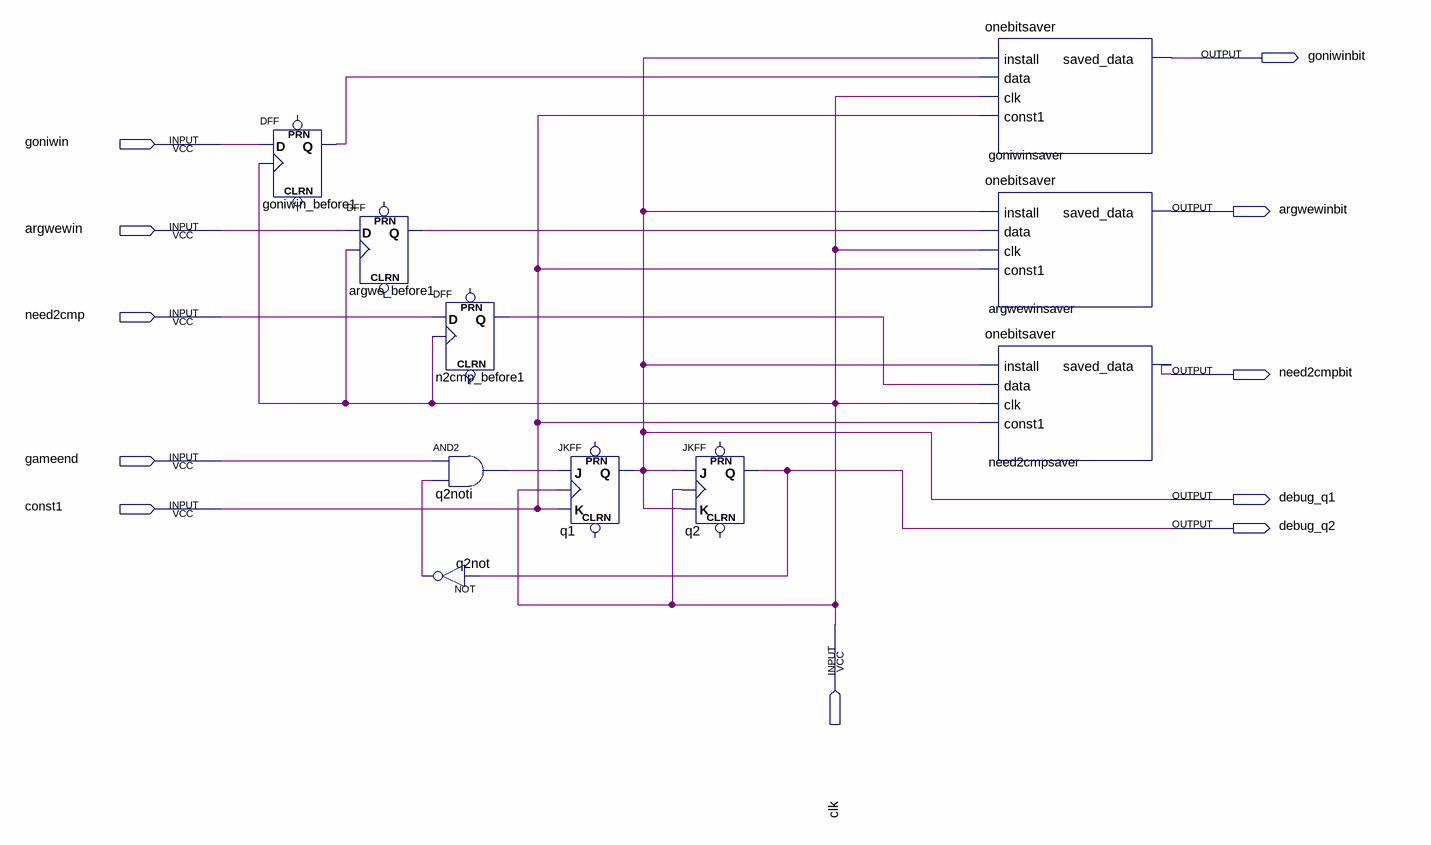
[diagram p0: schematic sheet]
// Quartus schematic battingsaver.bdf as structural Verilog: 10 symbols, 11 pins
module battingsaver (
  input  goniwin,
  input  argwewin,
  input  need2cmp,
  input  gameend,
  input  const1,
  input  clk,
  output goniwinbit,
  output argwewinbit,
  output need2cmpbit,
  output debug_q1,
  output debug_q2
);

  wire argwe_before1_q, goniwin_before1_q, n2cmp_before1_q, q2not_out, q2noti_out;

  DFF goniwin_before1 (.CLK(clk), .D(goniwin), .Q(goniwin_before1_q));  // open: CLRN, PRN
  DFF argwe_before1 (.CLK(clk), .D(argwewin), .Q(argwe_before1_q));  // open: CLRN, PRN
  DFF n2cmp_before1 (.CLK(clk), .D(need2cmp), .Q(n2cmp_before1_q));  // open: CLRN, PRN
  and q2noti (q2noti_out, gameend, q2not_out);
  not q2not (q2not_out, debug_q2);
  JKFF q1 (.K(const1), .J(q2noti_out), .CLK(clk), .Q(debug_q1));  // open: PRN, CLRN
  JKFF q2 (.K(debug_q1), .J(debug_q1), .CLK(clk), .Q(debug_q2));  // open: PRN, CLRN
  onebitsaver goniwinsaver (
    .install(debug_q1), .data(goniwin_before1_q), .clk(clk), .const1(const1), .saved_data(goniwinbit));
  onebitsaver argwewinsaver (
    .install(debug_q1), .data(argwe_before1_q), .clk(clk), .const1(const1), .saved_data(argwewinbit));
  onebitsaver need2cmpsaver (
    .install(debug_q1), .data(n2cmp_before1_q), .clk(clk), .const1(const1), .saved_data(need2cmpbit));
endmodule
